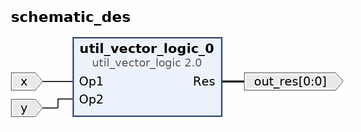
[diagram p0: block diagram of the top level]
# Vivado block design schematic_des, xc7a35tcpg236-1, Vivado 2019.1
create_bd_design schematic_des

create_bd_port -dir O -from 0 -to 0 out_res
create_bd_port -dir I x
create_bd_port -dir I y

create_bd_cell -type ip -vlnv xilinx.com:ip:util_vector_logic:2.0 util_vector_logic_0
set_property -dict {CONFIG.C_SIZE 1} [get_bd_cells util_vector_logic_0]

# ---- connections ----

connect_bd_net [get_bd_pins util_vector_logic_0/Res] [get_bd_ports out_res]
connect_bd_net [get_bd_ports x] [get_bd_pins util_vector_logic_0/Op1]
connect_bd_net [get_bd_ports y] [get_bd_pins util_vector_logic_0/Op2]

validate_bd_design
save_bd_design
